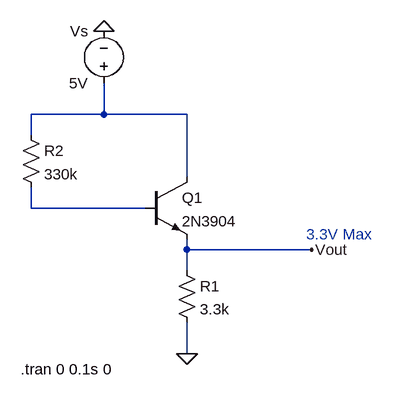
[diagram p0: schematic WaterSensor.asc]
WaterSensor.asc, the LTspice schematic file:
Version 4
SHEET 1 880 680
WIRE 112 16 112 -32
WIRE 112 16 0 16
WIRE 240 16 112 16
WIRE 0 48 0 16
WIRE 240 112 240 16
WIRE 0 160 0 128
WIRE 176 160 0 160
WIRE 240 224 240 208
WIRE 432 224 240 224
WIRE 240 256 240 224
WIRE 240 384 240 336
FLAG 240 384 0
FLAG 112 -112 0
FLAG 432 224 Vout
DATAFLAG 336 224 ""
DATAFLAG 80 160 ""
SYMBOL npn 176 112 R0
SYMATTR InstName Q1
SYMATTR Value 2N3904
SYMBOL res -16 32 R0
SYMATTR InstName R2
SYMATTR Value 330k
SYMBOL voltage 112 -16 R180
WINDOW 0 24 96 Left 2
WINDOW 3 24 16 Left 2
WINDOW 123 0 0 Left 0
WINDOW 39 0 0 Left 0
SYMATTR InstName Vs
SYMATTR Value 5V
SYMBOL res 224 240 R0
SYMATTR InstName R1
SYMATTR Value 3.3k
TEXT -16 408 Left 2 !.tran 0 0.1s 0
TEXT 424 200 Left 2 ;3.3V Max

The netlist it stands for:
* WaterSensor.asc
Q1 N001 N002 Vout 0 2N3904
R2 N001 N002 330k
Vs N001 0 5V
R1 Vout 0 3.3k
.model NPN NPN
.model PNP PNP
.lib standard.bjt
.tran 0 0.1s 0
* 3.3V Max
.backanno
.end